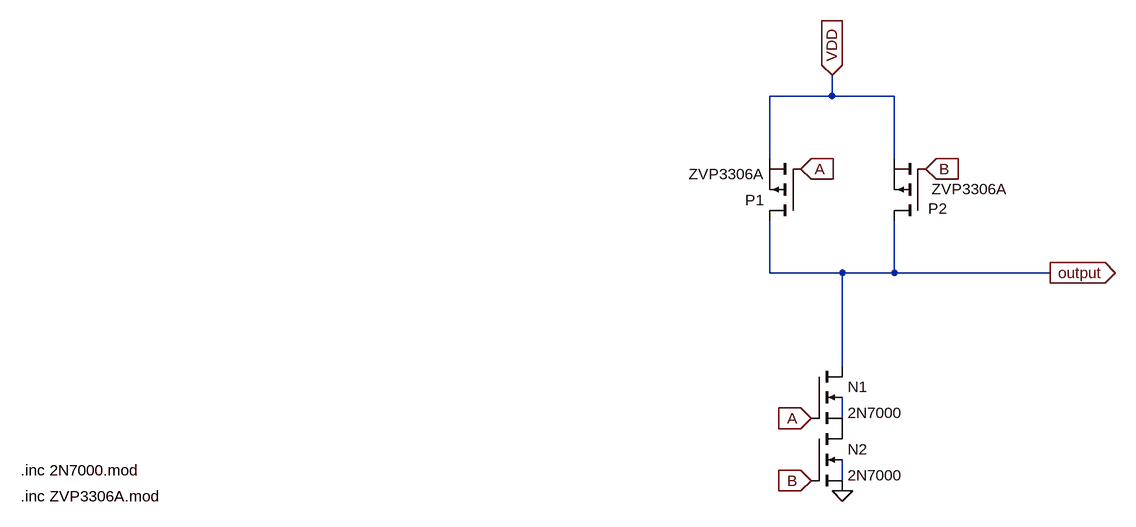
[diagram p0: schematic NAND.asc]
NAND.asc, the LTspice schematic file:
Version 4.1
SHEET 1 1872 680
WIRE 768 -208 768 -240
WIRE 768 -208 672 -208
WIRE 864 -208 768 -208
WIRE 672 -112 672 -208
WIRE 864 -112 864 -208
WIRE 672 64 672 -16
WIRE 784 64 672 64
WIRE 864 64 864 -16
WIRE 864 64 784 64
WIRE 1104 64 864 64
WIRE 784 208 784 64
WIRE 784 288 784 256
WIRE 784 384 784 352
FLAG 784 400 0
FLAG 768 -240 VDD
IOPIN 768 -240 In
FLAG 1104 64 output
IOPIN 1104 64 Out
FLAG 720 -96 A
IOPIN 720 -96 In
FLAG 736 288 A
IOPIN 736 288 In
FLAG 912 -96 B
IOPIN 912 -96 In
FLAG 736 384 B
IOPIN 736 384 In
SYMBOL pmos 720 -16 R180
SYMATTR InstName P1
SYMATTR Value ZVP3306A
SYMATTR Prefix X
SYMBOL nmos4 736 304 R0
SYMATTR InstName N2
SYMATTR Value 2N7000
SYMATTR Prefix X
SYMBOL pmos 912 -16 R180
WINDOW 0 -33 19 Left 2
WINDOW 3 -126 49 Left 2
SYMATTR InstName P2
SYMATTR Value ZVP3306A
SYMATTR Prefix X
SYMBOL nmos4 736 208 R0
SYMATTR InstName N1
SYMATTR Value 2N7000
SYMATTR Prefix X
TEXT -480 368 Left 2 !.inc 2N7000.mod
TEXT -480 408 Left 2 !.inc ZVP3306A.mod

The netlist it stands for:
* NAND.asc
X§P1 output A VDD ZVP3306A  ; pins D G S
X§N2 P001 B 0 N002 2N7000  ; pins D G S B
X§P2 output B VDD ZVP3306A  ; pins D G S
X§N1 output A P001 N001 2N7000  ; pins D G S B
.inc 2N7000.mod
.inc ZVP3306A.mod
.backanno
.end